# Altium schematic sheet PSU.SchDoc
size A4; SheetNumber: 1; SheetTotal: 3
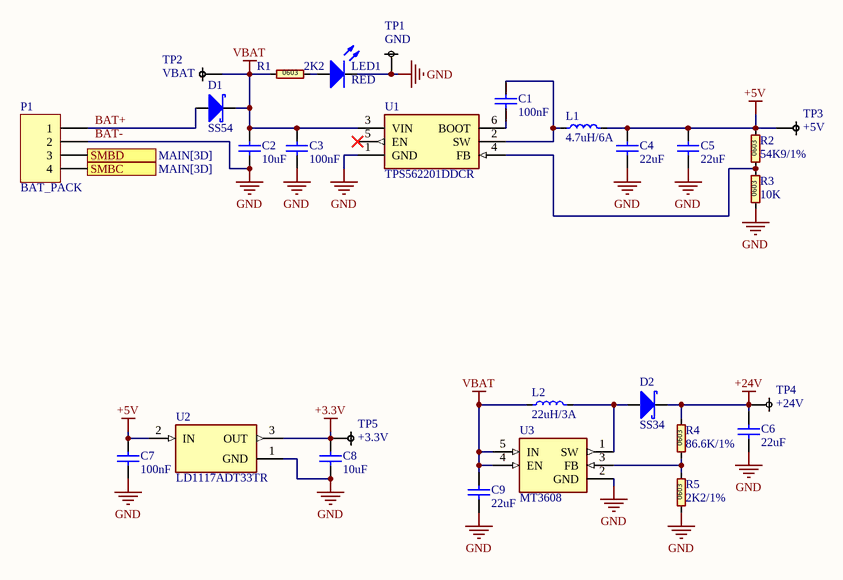
[diagram p0: PSU.SchDoc]

## Parts
C1  100nF  [C0603]
C2  10uF  [C1206]
C3  100nF  [C0603]
C4  22uF  [C0603]
C5  22uF  [C0603]
C6  22uF  [C1206]
C7  100nF  [C0603]
C8  10uF  [C1206]
C9  22uF  [C1206]
D1  SS54  [DO-214AC]
D2  SS34  [DO-214AC]
L1  4.7uH/6A  [IND_2926 (7467)]
L2  22uH/3A  [IND_2926 (7467)]
LED1  RED  [LED0603]
P1  BAT_PACK  [JST_XH-2.54]
R1  2K2  [R0603]
R2  54K9/1%  [R0603]
R3  10K  [R0603]
R4  86.6K/1%  [R0603]
R5  2K2/1%  [R0603]
TP1  GND  [PAD]
TP2  VBAT  [PAD]
TP3  +5V  [PAD]
TP4  +24V  [PAD_HOLE]
TP5  +3.3V  [PAD]
U1  TPS562201DDCR  [SOT-23-6]
U2  LD1117ADT33TR  [DPAK]
U3  MT3608  [SOT-23-6]

## Ports
SMBC (see MAIN[3D]), SMBD (see MAIN[3D])

## Nets
+3.3V: C8.2 TP5.1 U2.3(OUT)
+5V: C4.2 C5.2 C7.2 L1.2 R2.2 TP3.1 U2.2(IN)
+24V: C6.2 D2.C(K) R4.2 TP4.1
BAT-: C2.1 C3.1 C4.1 C5.1 C6.1 C7.1 C8.1 C9.1 LED1.2(K) P1.2 R3.1 R5.1 TP1.1 U1.1(GND) U2.1(GND) U3.2(GND)  [also labelled GND]
VBAT: C2.2 C3.2 C9.2 D1.C(K) L2.1 R1.1 TP2.1 U1.3(VIN) U3.4(EN) U3.5(IN)
BAT+: D1.A P1.1
SMBC: P1.4 ; port SMBC
SMBD: P1.3 ; port SMBD
NetC1_1: C1.1 U1.6(BOOT)
NetC1_2: C1.2 L1.1 U1.2(SW)
NetD2_A: D2.A L2.2 U3.1(SW)
NetLED1_1: LED1.1(A) R1.2
NetR2_1: R2.1 R3.2 U1.4(FB)
NetR4_1: R4.1 R5.2 U3.3(FB)

Not connected (* = marked no-connect by the designer): U1 5(EN)*

## Notes on the sheet
- Title:
- Author:
- Checked:
- Approved:
- Edited:
- CONFIDENTIAL
- Notes :
- Prj:
- github.com/abmnyy/about <https://github.com/abmnyy/about>
- Date:
- Version:
- Size:
- A4
- (in symbol Resistor 0603 (Inch)) 0603

## Library data of the parts
C1 = Capacitor 0603 (Inch): 0603 SMD Non-Polarity Capacitor; MFR.Part #: CC1206KRX7R9BB104; LCSC Part #: C82601; ComponentLink1Description: Datasheet; ComponentLink1URL: *
C2 = Capacitor 1206 (Inch): 1206 SMD Non-Polarity Capacitor; MFR.Part #: CC1206KKX5R9BB106; LCSC Part #: C100122; ComponentLink1Description: Datasheet; ComponentLink1URL: *
C3 C7 = Capacitor 0603 (Inch): 0603 SMD Non-Polarity Capacitor; MFR.Part #: *; LCSC Part #: *; ComponentLink1Description: Datasheet; ComponentLink1URL: *
C4 C5 = Capacitor 0603 (Inch): 0603 SMD Non-Polarity Capacitor; MFR.Part #: GRM188R61A226ME15D; LCSC Part #: C84419; ComponentLink1Description: Datasheet
  C4: ComponentLink1URL: *
  C5: ComponentLink1URL: https://www.lcsc.com/datasheet/C84419.pdf
C6 C9 = Capacitor 1206 (Inch): 1206 SMD Non-Polarity Capacitor; MFR.Part #: CC1206KKX5R8BB226; LCSC Part #: C2178233; ComponentLink1Description: Datasheet; ComponentLink1URL: *
C8 = Capacitor 1206 (Inch): 1206 SMD Non-Polarity Capacitor; MFR.Part #: *; LCSC Part #: *; ComponentLink1Description: Datasheet; ComponentLink1URL: *
D1 = SS54: 40V Independent 550mV@5A 5A SMA(DO-214AC) Schottky Diodes; MFR.Part #: SS54; LCSC Part #: C22452; ComponentLink1Description: Datasheet; ComponentLink1URL: https://www.lcsc.com/datasheet/C22452.pdf
D2 = SS34: Schottky SS34 DO-214AC; MFR.Part #: SS34; LCSC Part #: C3040628; ComponentLink1Description: Datasheet; ComponentLink1URL: https://www.lcsc.com/datasheet/C3040628.pdf
L1 = INDUCTOR 2926: Inductor with Package: 2926 (7467); MFR.Part #: FXL0630-4R7-M; LCSC Part #: C167220; ComponentLink1Description: Datasheet; ComponentLink1URL: https://www.lcsc.com/datasheet/C167220.pdf
L2 = INDUCTOR 2926: Inductor with Package: 2926 (7467); MFR.Part #: YSPI0630A-220M; LCSC Part #: C497873; ComponentLink1Description: Datasheet; ComponentLink1URL: https://www.lcsc.com/datasheet/C497873.pdf
LED1 = LED 0603: 0603 LED; MFR.Part #: KT-0603R; LCSC Part #: C2286; ComponentLink1Description: Datasheet; ComponentLink1URL: *
P1 = Connector 4P: CONNECTOR HEADER; LatestRevisionDate: 17-Jul-2002; LatestRevisionNote: Re-released for DXP Platform.; Publisher: Altium Limited
R1 R5 = Resistor 0603 (Inch): 0603 SMD Thick Resistor; MFR.Part #: RC0603JR-072K2L; LCSC Part #: C113303; ComponentLink1Description: Datasheet; ComponentLink1URL: *
R2 = Resistor 0603 (Inch): 0603 SMD Thick Resistor; MFR.Part #: RC0603FR-0754K9L; LCSC Part #: C185321; ComponentLink1Description: Datasheet; ComponentLink1URL: https://www.lcsc.com/datasheet/C185321.pdf
R3 = Resistor 0603 (Inch): 0603 SMD Thick Resistor; MFR.Part #: RC0603FR-0710KL; LCSC Part #: C98220; ComponentLink1Description: Datasheet; ComponentLink1URL: *
R4 = Resistor 0603 (Inch): 0603 SMD Thick Resistor; MFR.Part #: RC0603FR-0786K6L; LCSC Part #: C141683; ComponentLink1Description: Datasheet; ComponentLink1URL: https://www.lcsc.com/datasheet/C141683.pdf
TP1-TP5 = Test Point: Thick Pad
U1 = TPS562201DDCR: 4.5 V to 17 V input, 2 A output, synchronous step-down converter in Eco-mode; MFR.Part #: TPS562201DDCR; LCSC Part #: C90061; ComponentLink1Description: Datasheet; ComponentLink1URL: https://www.lcsc.com/datasheet/C90061.pdf
U2 = LD1117ADT33TR: Linear Voltage Regulator IC Positive Fixed 1 Output 3.3V 1A; MFR.Part #: LD1117ADT33TR; LCSC Part #: C157401; ComponentLink1Description: Datasheet; ComponentLink1URL: https://www.lcsc.com/datasheet/C157401.pdf
U3 = MT3608: High Efficiency 1.2MHz2A Step Up Converter; MFR.Part #: MT3608; LCSC Part #: C84817; ComponentLink1Description: Datasheet; ComponentLink1URL: https://www.lcsc.com/datasheet/C84817.pdf